# Altium schematic sheet RF Front.SchDoc
size A2
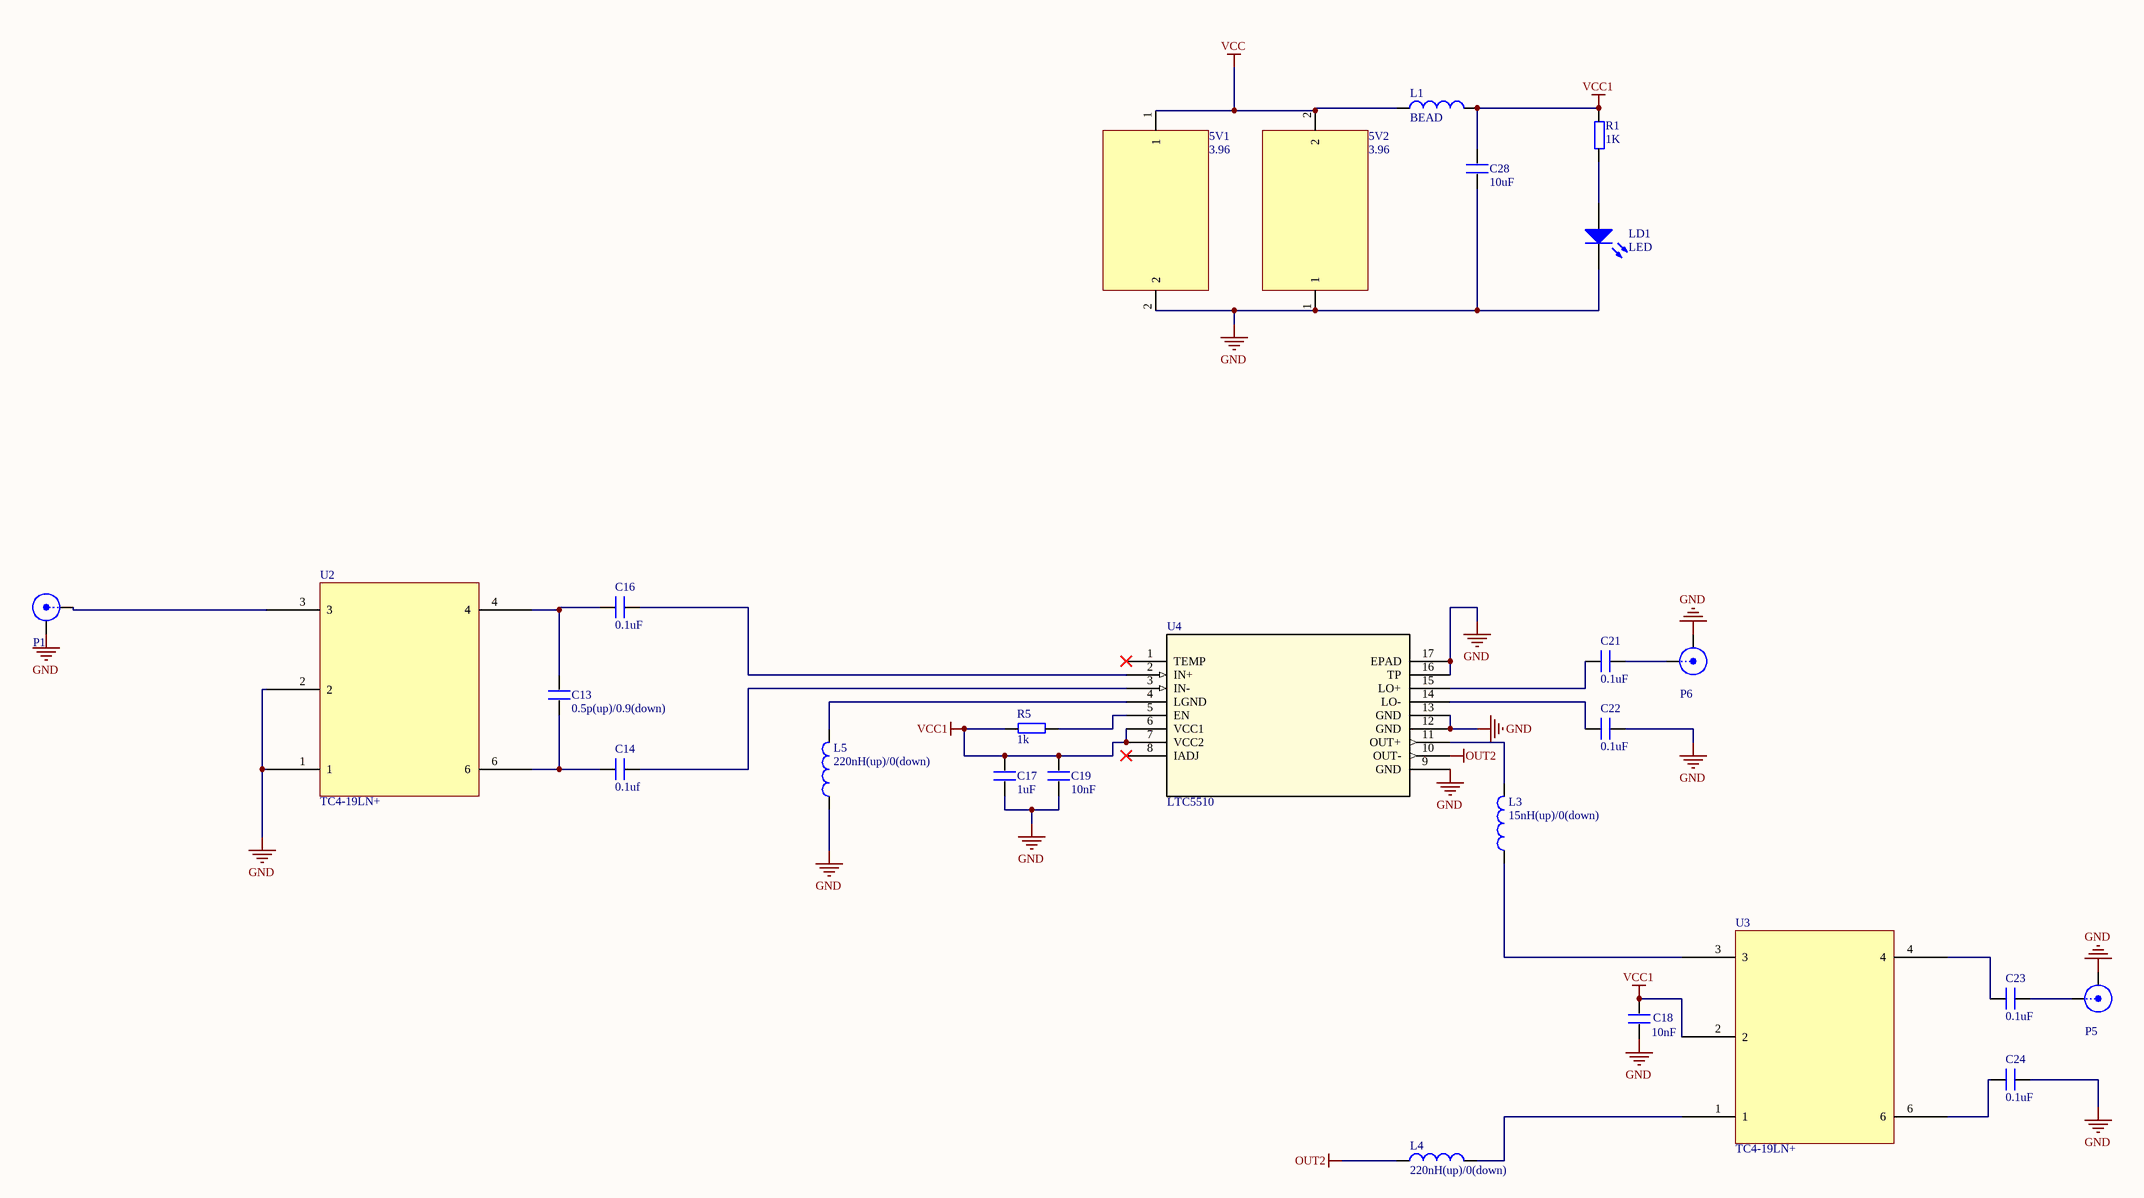
[diagram p0: RF Front.SchDoc]

## Parts
5V1  3.96  [3.96]
5V2  3.96  [3.96]
C13  0.5p(up)/0.9(down)  [0402]
C14  0.1uf  [0402]
C16  0.1uF  [0402]
C17  1uF  [0402]
C18  10nF  [0402]
C19  10nF  [0402]
C21  0.1uF  [0402]
C22  0.1uF  [0402]
C23  0.1uF  [0402]
C24  0.1uF  [0402]
C28  10uF  [0603C]
L1  BEAD  [0603L]
L3  15nH(up)/0(down)  [0603L]
L4  220nH(up)/0(down)  [0603L]
L5  220nH(up)/0(down)  [0603L]
LD1  LED  [SMDLED]
P1  SMA  [SMA]  (value not drawn)
P5  SMA  [SMA]  (value not drawn)
P6  SMA  [SMA]  (value not drawn)
R1  1K  [0603R]
R5  1k  [0603R]
U2  TC4-19LN+  [AT224]
U3  TC4-19LN+  [AT224]
U4  LTC5510  [QFN-16_UF]

## Nets
GND: 5V1.2 5V2.1 C17.2 C18.1 C19.2 C22.2 C24.2 C28.1 L5.1 LD1.2(K) P1.2(Y) P5.2(Y) P6.2(Y) U2.1 U2.2 U4.9(GND) U4.12(GND) U4.13(GND) U4.16(TP) U4.17(EPAD)
OUT2: L4.1 U4.10(OUT-)
VCC: 5V1.1 5V2.2 L1.1
VCC1: C17.1 C18.2 C19.1 C28.2 L1.2 R1.2 R5.2 U3.2 U4.6(VCC1) U4.7(VCC2)
NetC13_1: C13.1 C14.2 U2.6
NetC13_2: C13.2 C16.1 U2.4
NetC14_1: C14.1 U4.3(IN-)
NetC16_2: C16.2 U4.2(IN+)
NetC21_1: C21.1 P6.1(X)
NetC21_2: C21.2 U4.15(LO+)
NetC22_1: C22.1 U4.14(LO-)
NetC23_1: C23.1 U3.4
NetC23_2: C23.2 P5.1(X)
NetC24_1: C24.1 U3.6
NetL3_1: L3.1 U3.3
NetL3_2: L3.2 U4.11(OUT+)
NetL4_2: L4.2 U3.1
NetL5_2: L5.2 U4.4(LGND)
NetLD1_1: LD1.1(A) R1.1
NetP1_1: P1.1(X) U2.3
NetR5_1: R5.1 U4.5(EN)

Not connected (* = marked no-connect by the designer): U4 1(TEMP)* 8(IADJ)*

## Library data of the parts
C13 C14 C16-C19 C21-C24 C28 = C: Capacitor
L1 L3-L5 = Inductor: Value: 100uH; Published: 8-Jun-2000; Revision: July-2002: Re-released for DXP Platform.; Publisher: Altium Limited
LD1 = LED: Typical RED, GREEN, YELLOW, AMBER GaAs LED; Published: 8-Jun-2000; LatestRevisionDate: 17-Jul-2002; LatestRevisionNote: Re-released for DXP Platform.; PackageDocument: Feb-2002; PackageReference: 3.2X1.6X1.1; Publisher: Altium Limited
P1 P5 P6 = SMA: SMA Connector
R1 R5 = Resistor
U4 = LTC5510: 1MHz 至 6GHz、宽带、高线性度有源混频器; Manufacturer_Part_Number: LTC5510IUF#TRPBF; Vendor: Linear Technology; Built_By: EMA_UL_Team; Copyright: Copyright (C) 2018 Accelerated Designs. All rights reserved; RefDes: RefDes; Type: DEV; Value: Value